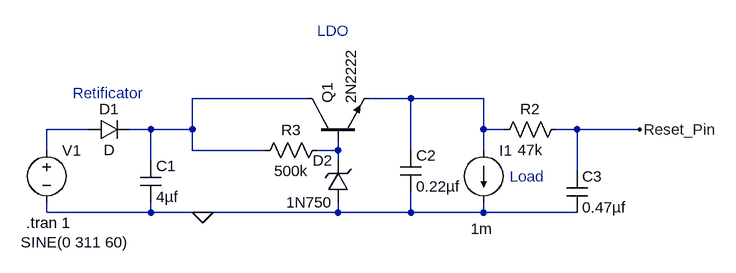
[diagram p0: schematic Startup-PowerSupplySource.asc]
Startup-PowerSupplySource.asc, the LTspice schematic file:
Version 4
SHEET 1 932 680
WIRE 288 64 112 64
WIRE 448 64 384 64
WIRE 560 64 448 64
WIRE -48 112 -112 112
WIRE 48 112 16 112
WIRE 112 112 112 64
WIRE 112 112 48 112
WIRE 560 112 560 64
WIRE 592 112 560 112
WIRE 704 112 672 112
WIRE 800 112 704 112
WIRE -112 144 -112 112
WIRE 112 144 112 112
WIRE 224 144 112 144
WIRE 336 144 336 128
WIRE 336 144 304 144
WIRE 448 144 448 64
WIRE 560 144 560 112
WIRE 48 160 48 112
WIRE 336 160 336 144
WIRE 704 176 704 112
WIRE -112 240 -112 224
WIRE 48 240 48 224
WIRE 48 240 -112 240
WIRE 128 240 48 240
WIRE 336 240 336 224
WIRE 336 240 128 240
WIRE 448 240 448 208
WIRE 448 240 336 240
WIRE 560 240 560 224
WIRE 560 240 448 240
WIRE 704 240 560 240
FLAG 128 240 0
FLAG 800 112 Reset_Pin
SYMBOL voltage -112 128 R0
WINDOW 123 0 0 Left 2
WINDOW 39 0 0 Left 2
WINDOW 3 -40 158 Left 2
SYMATTR InstName V1
SYMATTR Value SINE(0 311 60)
SYMBOL diode -48 128 R270
WINDOW 0 32 32 VTop 2
WINDOW 3 0 32 VBottom 2
SYMATTR InstName D1
SYMBOL cap 32 160 R0
SYMATTR InstName C1
SYMATTR Value 4µf
SYMBOL cap 432 144 R0
SYMATTR InstName C2
SYMATTR Value 0.22µf
SYMBOL zener 352 224 R180
WINDOW 0 24 64 Left 2
WINDOW 3 24 0 Left 2
SYMATTR InstName D2
SYMATTR Value 1N750
SYMATTR Description Diode
SYMATTR Type diode
SYMBOL current 560 144 R0
WINDOW 3 -20 121 Left 2
WINDOW 123 0 0 Left 2
WINDOW 39 0 0 Left 2
SYMATTR Value 1m
SYMATTR InstName I1
SYMBOL res 688 96 R90
WINDOW 0 0 56 VBottom 2
WINDOW 3 32 56 VTop 2
SYMATTR InstName R2
SYMATTR Value 47k
SYMBOL cap 688 176 R0
SYMATTR InstName C3
SYMATTR Value 0.47µf
SYMBOL npn 288 128 R270
SYMATTR InstName Q1
SYMATTR Value 2N2222
SYMBOL res 320 128 R90
WINDOW 0 0 56 VBottom 2
WINDOW 3 32 56 VTop 2
SYMATTR InstName R3
SYMATTR Value 500k
TEXT -144 256 Left 2 !.tran 1
TEXT -72 56 Left 2 ;Retificator
TEXT 304 -40 Left 2 ;LDO
TEXT 600 184 Left 2 ;Load

The netlist it stands for:
* Startup-PowerSupplySource.asc
V1 N003 0 SINE(0 311 60)
D1 N003 N001 D
C1 N001 0 4µf
C2 N002 0 0.22µf
D2 0 N004 1N750
I1 N002 0 1m
R2 Reset_Pin N002 47k
C3 Reset_Pin 0 0.47µf
Q1 N001 N004 N002 0 2N2222
R3 N004 N001 500k
.model D D
.lib standard.dio
.model NPN NPN
.model PNP PNP
.lib standard.bjt
.tran 1
* Retificator
* LDO
* Load
.backanno
.end